# EAGLE design watch (EAGLE 6.6.0)
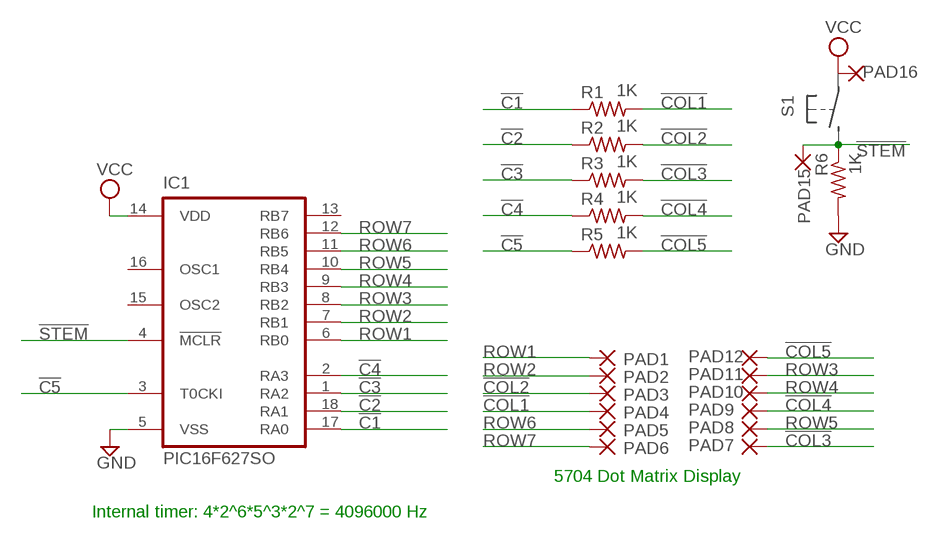
[diagram p0: schematic, sheet 1]

## Parts
IC1  PIC16F627SO  PIC16C622SO  [SO-18W]
PAD1  SMD2  [SMD1,27-2,54]
PAD2  SMD2  [SMD1,27-2,54]
PAD3  SMD2  [SMD1,27-2,54]
PAD4  SMD2  [SMD1,27-2,54]
PAD5  SMD2  [SMD1,27-2,54]
PAD6  SMD2  [SMD1,27-2,54]
PAD7  SMD2  [SMD1,27-2,54]
PAD8  SMD2  [SMD1,27-2,54]
PAD9  SMD2  [SMD1,27-2,54]
PAD10  SMD2  [SMD1,27-2,54]
PAD11  SMD2  [SMD1,27-2,54]
PAD12  SMD2  [SMD1,27-2,54]
PAD15  SMD2  [SMD1,27-2,54]
PAD16  SMD2  [SMD1,27-2,54]
R1  1K  R-US_R0805  [R0805]
R2  1K  R-US_R0805  [R0805]
R3  1K  R-US_R0805  [R0805]
R4  1K  R-US_R0805  [R0805]
R5  1K  R-US_R0805  [R0805]
R6  1K  R-US_R0805  [R0805]

## Nets
!C1: IC1.17(RA0) R1.1
!C2: IC1.18(RA1) R2.1
!C3: IC1.1(RA2) R3.1
!C4: IC1.2(RA3) R4.1
!C5: IC1.3(T0CKI) R5.1
!COL1: PAD4.1(P) R1.2
!COL2: PAD3.1(P) R2.2
!COL3: PAD7.1(P) R3.2
!COL4: PAD9.1(P) R4.2
!COL5: PAD12.1(P) R5.2
!STEM: IC1.4(!MCLR) PAD15.1(P) R6.1
GND: IC1.5(VSS) R6.2
ROW1: IC1.6(RB0) PAD1.1(P)
ROW2: IC1.7(RB1) PAD2.1(P)
ROW3: IC1.8(RB2) PAD11.1(P)
ROW4: IC1.9(RB3) PAD10.1(P)
ROW5: IC1.10(RB4) PAD8.1(P)
ROW6: IC1.11(RB5) PAD5.1(P)
ROW7: IC1.12(RB6) PAD6.1(P)
VCC: IC1.14(VDD) PAD16.1(P)
Unconnected: IC1.13(RB7) IC1.15(OSC2) IC1.16(OSC1)

## Notes on the sheet
- 5704 Dot Matrix Display
- Internal timer: 4*2^6*5^3*2^7 = 4096000 Hz

## Library data of the parts
IC1 = microchip:PIC16C*: MICROCONTROLLER PIC16C5X family: EPROM/ROM-based PIC16C55X family: EPROM-based PIC16C6X family PIC16CE62X family: analog comparators/EEPROM data memory PIC16C7X family: A/D converter PIC16C71X family: A/D converter PIC16F8X family: flash EEPROM Pin compatible devices: PIC16C154, PIC16CR154, PIC16C156, PIC16CR156, PIC16C158 PIC16CR158, PIC16C52, PIC16C54, PIC16C54A, PIC16CR54A PIC16C56, PIC16C58A, PIC16CR58A, PIC16C61, PIC16C554 PIC16C556, PIC16C558, PIC16C620, PIC16C621, PIC16C622 PIC16C641, PIC16C642, PIC16C661, PIC16C662, PIC16C71 PIC16C710, PIC16C711, PIC16C715, PIC126F83, PIC16CR83 PIC16F84A, PIC16CR84 see also PIC16F8* <DEVICE:PIC16F8*>; MF: MICROCHIP; MPN: PIC16C622A-04I/SO; OC_FARNELL: 9759522; OC_NEWARK: 23C3985
PAD1-PAD12 PAD15 PAD16 = wirepad:SMD2: SMD PAD
R1-R6 = rcl:R-US_: RESISTOR, American symbol

## Board
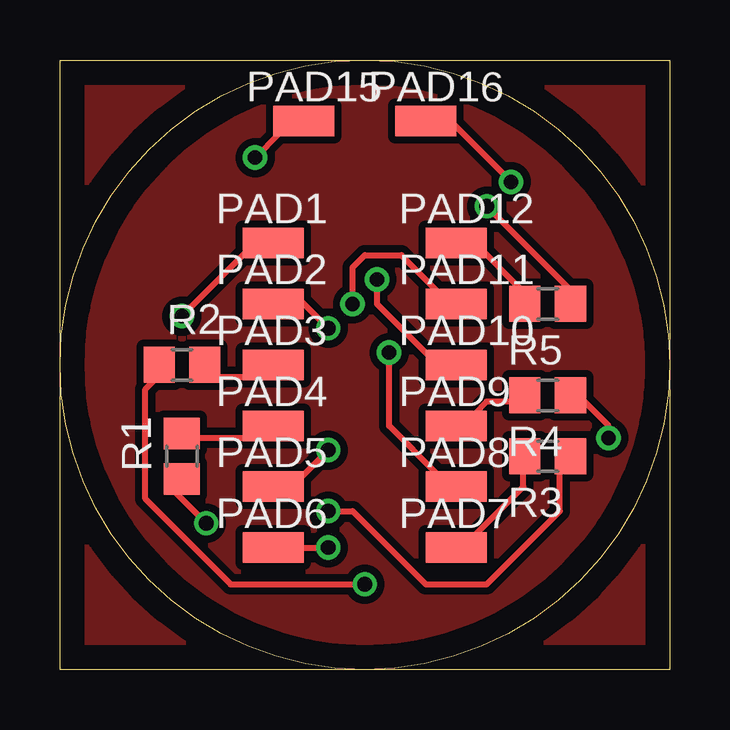
[diagram p1: board, top side]
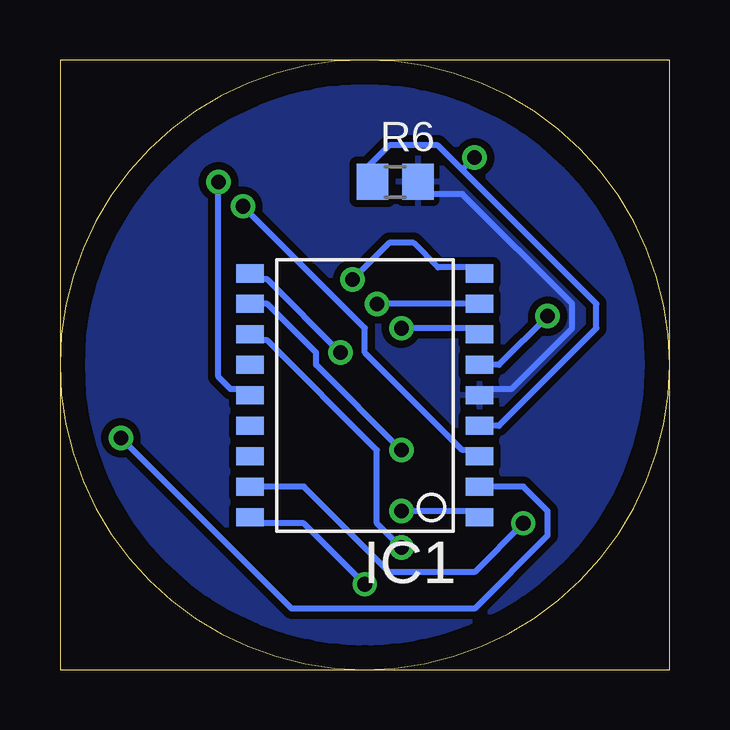
[diagram p2: board, bottom side, seen from below]

Size 25.4 x 25.4 mm. Coordinates in mm from the lower left corner, seen from the top.
Outline: 0,12.7 0,0 25.4,0 25.4,12.7
Outline: 0,12.7 0,25.4 24.13,25.4 25.4,25.4 25.4,12.7
Outline: 0,12.7 arc-180 25.4,12.7
Outline: 25.4,12.7 arc-180 0,12.7
Copper layers (1*16): Top 0.035mm / dielectric 1.5mm / Bottom 0.035mm
Design rules "custompcb": minimum track width 10mil, minimum drill 24mil, track to track 12mil, track to pad 12mil, pad to pad 12mil, via to via 12mil, smd to smd 12mil, copper to edge 40mil, drill to drill 12mil, minimum pad ring 10mil, minimum via ring 8mil, stop-mask expansion 0mil, vias tented up to drill 0mil, thermal gap 10mil

### Footprints (pad centres in the part's own frame; a part is rotated, then mirrored left to right if it is on the bottom)
SO-18W = smd 0.762 x 1.143: 1 -5.08,-4.788; 2 -3.81,-4.788; 3 -2.54,-4.788; 4 -1.27,-4.788; 5 0,-4.788; 6 1.27,-4.788; 7 2.54,-4.788; 8 3.81,-4.788; 9 5.08,-4.788; 10 5.08,4.788; 11 3.81,4.788; 12 2.54,4.788; 13 1.27,4.788; 14 0,4.788; 15 -1.27,4.788; 16 -2.54,4.788; 17 -3.81,4.788; 18 -5.08,4.788
SMD1,27-2,54 = smd 1.27 x 2.54: 1 0,0
R0805 = smd 1.3 x 1.5: 1 -0.95,0; 2 0.95,0

### Placement (x,y rotation side)
IC1  12.7,11.43 90 bottom
PAD1  8.89,17.78 270 top
PAD2  8.89,15.24 270 top
PAD3  8.89,12.7 270 top
PAD4  8.89,10.16 270 top
PAD5  8.89,7.62 270 top
PAD6  8.89,5.08 270 top
PAD7  16.51,5.08 270 top
PAD8  16.51,7.62 270 top
PAD9  16.51,10.16 270 top
PAD10  16.51,12.7 270 top
PAD11  16.51,15.24 270 top
PAD12  16.51,17.78 270 top
PAD15  10.16,22.86 270 top
PAD16  15.24,22.86 270 top
R1  5.08,8.89 90 top
R2  5.08,12.7 0 top
R3  20.32,8.89 180 top
R4  20.32,11.43 180 top
R5  20.32,15.24 180 top
R6  11.43,20.32 0 bottom

### Tracks (layer width: path | path; a pad name or v marks a point on that pad's centre or on a via)
!C1  (via drill 0.61)
  Top 0.254: v6.1,6.1 4.57,7.62 R1.1
  Bottom 0.254: v6.1,6.1 8.13,4.06 11.68,4.06 15.24,7.62 17.27,7.62 IC1.17
!C2  (via drill 0.61)
  Top 0.254: v12.7,3.56 7.11,3.56 3.56,7.11 3.56,11.68 4.06,12.19 R2.1
  Bottom 0.254: v12.7,3.56 15.24,6.1 17.27,6.1 IC1.18
!C3  (via drill 0.61)
  Top 0.254: v11.18,6.6 12.19,6.6 15.24,3.56 17.78,3.56 20.83,6.6 20.83,8.64 R3.1
  Bottom 0.254: v11.18,6.6 8.13,6.6 IC1.1
!C4  (via drill 0.61)
  Top 0.254: v22.86,9.65 22.86,10.16 21.34,11.68 R4.1
  Bottom 0.254: v22.86,9.65 15.75,2.54 8.13,2.54 5.08,5.59 5.08,6.6 6.1,7.62 7.62,7.62 IC1.2
!C5  (via drill 0.61)
  Top 0.254: v17.78,19.3 21.34,15.75 R5.1
  Bottom 0.254: v17.78,19.3 12.7,14.22 12.7,13.21 8.64,9.14 8.13,9.14 IC1.3
!COL1
  Top 0.254: R1.2 5.59,9.65 8.13,9.65 PAD4.1
!COL2
  Top 0.254: R2.2 6.1,12.19 8.13,12.19 PAD3.1
!COL3
  Top 0.254: R3.2 19.3,8.64 19.3,7.62 17.27,5.59 PAD7.1
!COL4
  Top 0.254: R4.2 19.3,11.18 17.78,11.18 17.27,10.67 PAD9.1
!COL5
  Top 0.254: R5.2 19.3,15.75 17.27,17.78 PAD12.1
!STEM  (via drill 0.61)
  Top 0.254: v8.13,21.34 9.14,22.35 PAD15.1
  Bottom 0.254: 8.64,20.83 9.65,21.84 11.68,21.84 12.7,20.83 R6.1 | 8.64,20.83 3.05,15.24 3.05,14.22 7.11,10.16 7.62,10.16 IC1.4 | 8.64,20.83 v8.13,21.34
GND
  Bottom 0.254: IC1.5 7.62,11.68 6.6,11.68 4.06,14.22 4.06,15.24 8.64,19.81 10.16,19.81 R6.2
  pour Top: 0,0 25.4,0 25.4,25.4 0,25.4
  pour Bottom: 0,0 25.4,0 25.4,25.4 0,25.4
ROW1  (via drill 0.61)
  Top 0.254: v5.08,14.73 8.13,17.78 PAD1.1
  Bottom 0.254: v5.08,14.73 7.11,12.7 7.62,12.7 IC1.6
ROW2  (via drill 0.61)
  Top 0.254: v11.18,14.22 9.65,15.75 PAD2.1
  Bottom 0.254: v11.18,14.22 8.13,14.22 IC1.7
ROW3  (via drill 0.61)
  Top 0.254: v12.19,15.24 12.19,16.76 12.7,17.27 14.22,17.27 15.75,15.75 PAD11.1
  Bottom 0.254: v12.19,15.24 8.13,15.24 IC1.8
ROW4  (via drill 0.61)
  Top 0.254: v13.21,16.26 13.21,15.24 15.75,12.7 PAD10.1
  Bottom 0.254: v13.21,16.26 11.68,17.78 10.67,17.78 9.65,16.76 8.13,16.76 IC1.9
ROW5  (via drill 0.61)
  Top 0.254: v13.72,13.21 13.72,10.16 15.75,8.13 PAD8.1
  Bottom 0.254: v13.72,13.21 16.76,16.26 17.27,16.26 IC1.10
ROW6  (via drill 0.61)
  Top 0.254: v11.18,9.14 9.65,7.62 PAD5.1
  Bottom 0.254: v11.18,9.14 14.73,12.7 14.73,13.21 16.76,15.24 17.27,15.24 IC1.11
ROW7  (via drill 0.61)
  Top 0.254: v11.18,5.08 9.65,5.08 PAD6.1
  Bottom 0.254: v11.18,5.08 12.19,6.1 12.19,9.14 16.76,13.72 17.27,13.72 IC1.12
VCC  (via drill 0.61)
  Top 0.254: v18.8,20.32 16.26,22.86 PAD16.1
  Bottom 0.254: v18.8,20.32 18.8,12.19 18.29,11.68 17.78,11.68 IC1.14